# Altium schematic sheet MergeBoard.SchDoc
size A
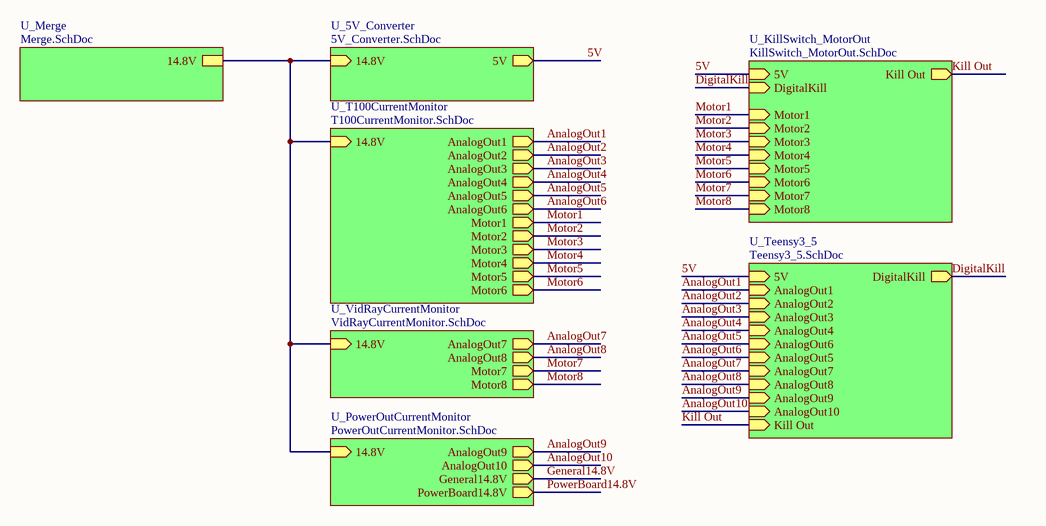
[diagram p0: MergeBoard.SchDoc]

## Sub-sheets
U_5V_Converter = 5V_Converter.SchDoc: 14.8V (in), 5V (out)
U_KillSwitch_MotorOut = KillSwitch_MotorOut.SchDoc: Motor8 (in), Motor7 (in), DigitalKill (in), Kill Out (out), Motor1 (in), Motor2 (in), Motor3 (in), Motor4 (in), Motor5 (in), Motor6 (in), 5V (in)
U_Merge = Merge.SchDoc: 14.8V
U_PowerOutCurrentMonitor = PowerOutCurrentMonitor.SchDoc: General14.8V (out), PowerBoard14.8V (out), 14.8V (in), AnalogOut9 (out), AnalogOut10 (out)
U_T100CurrentMonitor = T100CurrentMonitor.SchDoc: AnalogOut1 (out), AnalogOut2 (out), AnalogOut3 (out), AnalogOut4 (out), AnalogOut5 (out), AnalogOut6 (out), Motor1 (out), Motor2 (out), Motor3 (out), Motor4 (out), Motor5 (out), Motor6 (out), 14.8V (in)
U_Teensy3_5 = Teensy3_5.SchDoc: 5V (in), DigitalKill (out), AnalogOut1 (in), AnalogOut2 (in), AnalogOut3 (in), AnalogOut4 (in), AnalogOut6 (in), AnalogOut5 (in), AnalogOut7 (in), AnalogOut8 (in), Kill Out (in), AnalogOut9 (in), AnalogOut10 (in)
U_VidRayCurrentMonitor = VidRayCurrentMonitor.SchDoc: AnalogOut7 (out), AnalogOut8 (out), Motor7 (out), Motor8 (out), 14.8V (in)

## Nets
5V: sheet U_5V_Converter/5V, sheet U_Teensy3_5/5V, sheet U_KillSwitch_MotorOut/5V
AnalogOut1: sheet U_T100CurrentMonitor/AnalogOut1, sheet U_Teensy3_5/AnalogOut1
AnalogOut2: sheet U_T100CurrentMonitor/AnalogOut2, sheet U_Teensy3_5/AnalogOut2
AnalogOut3: sheet U_T100CurrentMonitor/AnalogOut3, sheet U_Teensy3_5/AnalogOut3
AnalogOut4: sheet U_T100CurrentMonitor/AnalogOut4, sheet U_Teensy3_5/AnalogOut4
AnalogOut5: sheet U_T100CurrentMonitor/AnalogOut5, sheet U_Teensy3_5/AnalogOut6
AnalogOut6: sheet U_T100CurrentMonitor/AnalogOut6, sheet U_Teensy3_5/AnalogOut5
AnalogOut7: sheet U_VidRayCurrentMonitor/AnalogOut7, sheet U_Teensy3_5/AnalogOut7
AnalogOut8: sheet U_VidRayCurrentMonitor/AnalogOut8, sheet U_Teensy3_5/AnalogOut8
AnalogOut9: sheet U_PowerOutCurrentMonitor/AnalogOut9, sheet U_Teensy3_5/AnalogOut9
AnalogOut10: sheet U_PowerOutCurrentMonitor/AnalogOut10, sheet U_Teensy3_5/AnalogOut10
DigitalKill: sheet U_Teensy3_5/DigitalKill, sheet U_KillSwitch_MotorOut/DigitalKill
General14.8V: sheet U_PowerOutCurrentMonitor/General14.8V
Kill Out: sheet U_Teensy3_5/Kill Out, sheet U_KillSwitch_MotorOut/Kill Out
Motor1: sheet U_T100CurrentMonitor/Motor1, sheet U_KillSwitch_MotorOut/Motor1
Motor2: sheet U_T100CurrentMonitor/Motor2, sheet U_KillSwitch_MotorOut/Motor2
Motor3: sheet U_T100CurrentMonitor/Motor3, sheet U_KillSwitch_MotorOut/Motor3
Motor4: sheet U_T100CurrentMonitor/Motor4, sheet U_KillSwitch_MotorOut/Motor4
Motor5: sheet U_T100CurrentMonitor/Motor5, sheet U_KillSwitch_MotorOut/Motor5
Motor6: sheet U_T100CurrentMonitor/Motor6, sheet U_KillSwitch_MotorOut/Motor6
Motor7: sheet U_VidRayCurrentMonitor/Motor7, sheet U_KillSwitch_MotorOut/Motor7
Motor8: sheet U_VidRayCurrentMonitor/Motor8, sheet U_KillSwitch_MotorOut/Motor8
PowerBoard14.8V: sheet U_PowerOutCurrentMonitor/PowerBoard14.8V
(unnamed): sheet U_5V_Converter/14.8V, sheet U_T100CurrentMonitor/14.8V, sheet U_VidRayCurrentMonitor/14.8V, sheet U_PowerOutCurrentMonitor/14.8V, sheet U_Merge/14.8V